# EAGLE design MotorDrive_REVB2 (EAGLE 6.2)

## Sheet 1 of 3
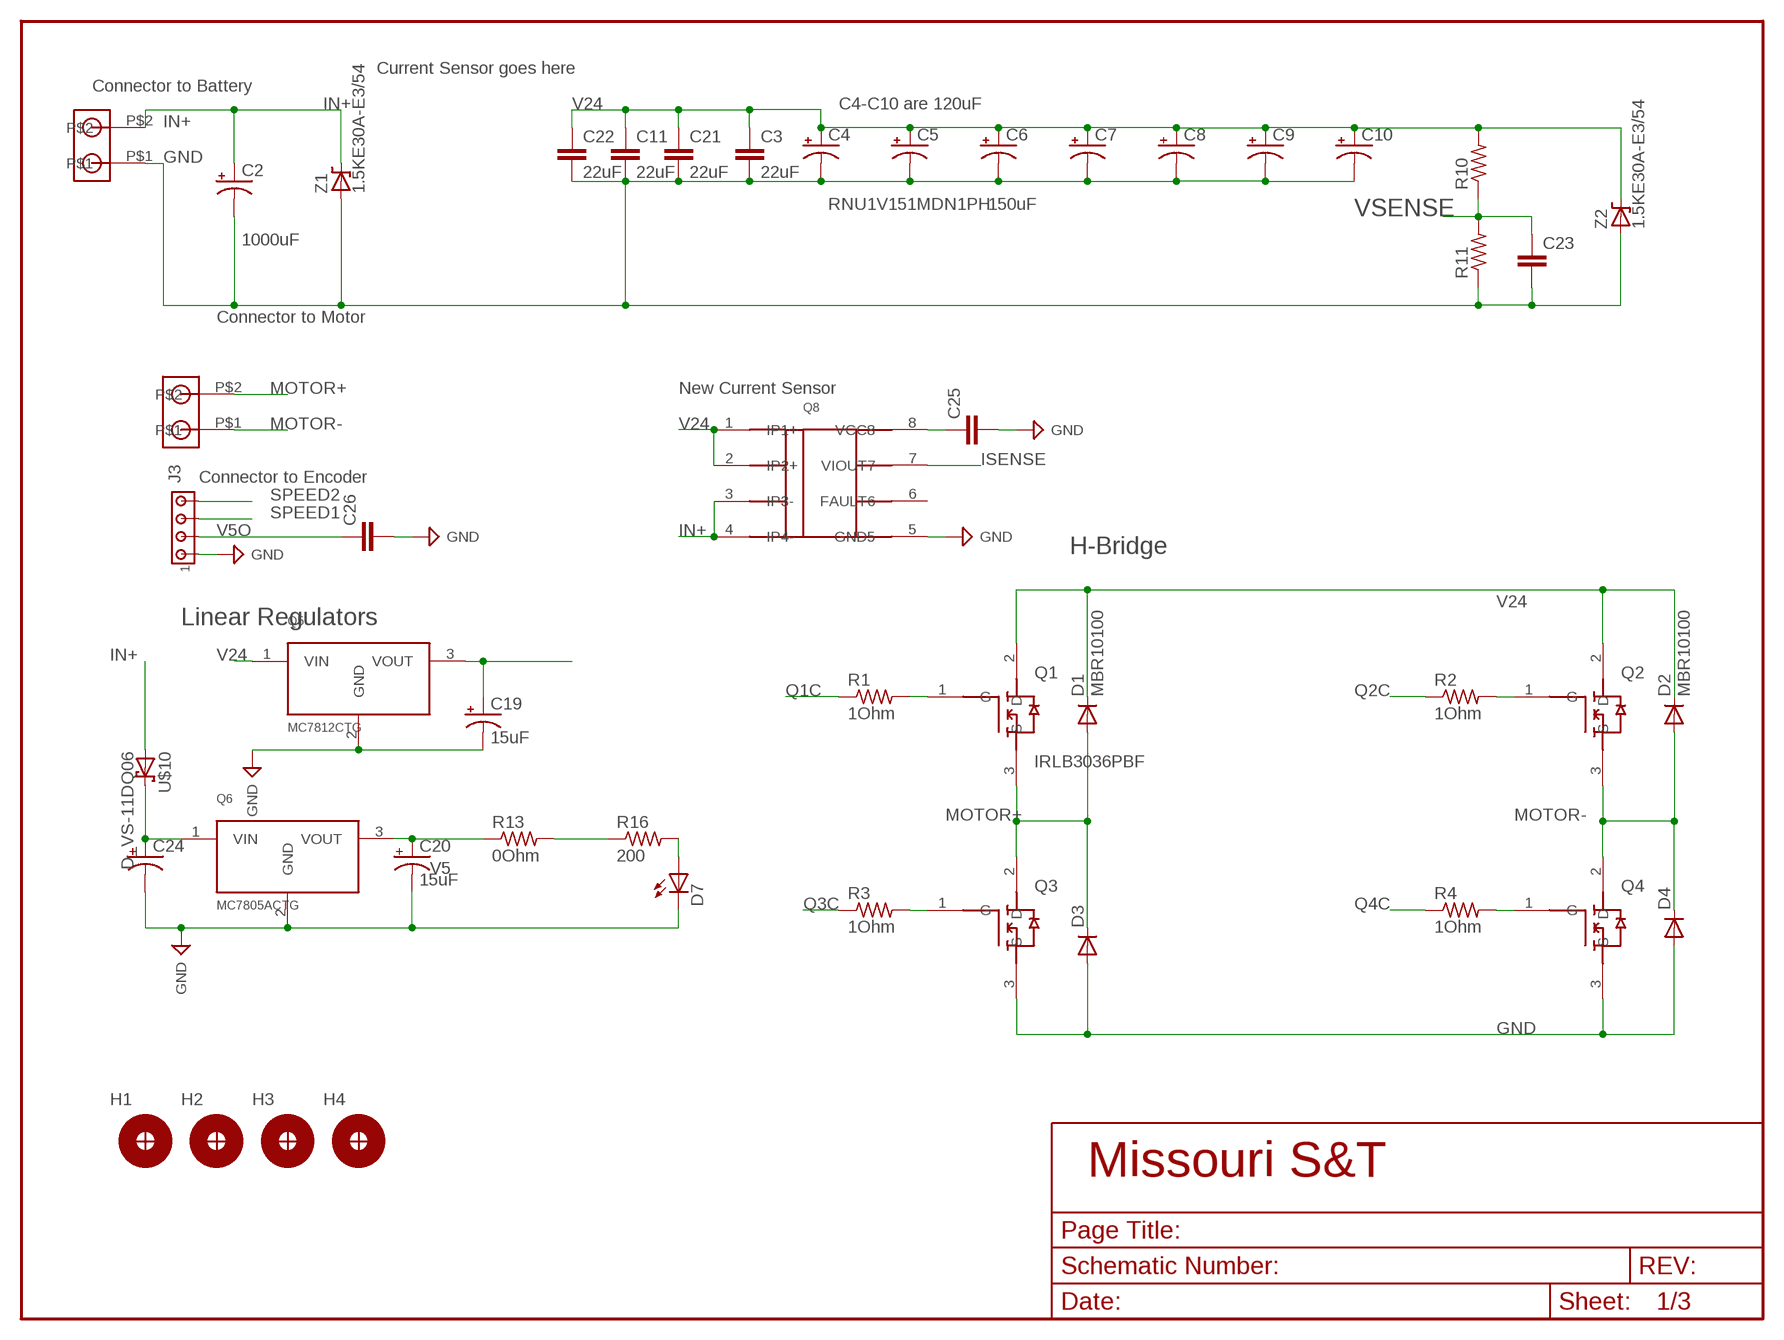
[diagram p0: schematic, sheet 1]

### Parts
C2  1000uF  C_10MM  [C_10MM]
C3  22uF  C_CAP_1206  [C_1206]
C4  RNU1V151MDN1PH  C_10MM  [C_10MM]
C5  C_10MM  [C_10MM]
C6  C_10MM  [C_10MM]
C7  C_10MM  [C_10MM]
C8  C_10MM  [C_10MM]
C9  C_10MM  [C_10MM]
C10  150uF  C_10MM  [C_10MM]
C11  22uF  C_CAP_1206  [C_1206]
C19  15uF  C_GA1E150  [C_2MM]
C20  15uF  C_POL8MM  [C_8MM]
C21  22uF  C_CAP_1206  [C_1206]
C22  22uF  C_CAP_1206  [C_1206]
C23  C_CAP_1206  [C_1206]
C24  C_POL_RAD_D8MM_LS200MIL_30MIL  [C_RAD_D8MM_LS200MIL_30MIL]
C25  C_CAP_1206  [C_1206]
C26  C_CAP_1206  [C_1206]
D1  MBR10100  D_FFPF10UA60ST  [TO220AC]
D2  MBR10100  D_FFPF10UA60ST  [TO220AC]
D3  D_FFPF10UA60ST  [TO220AC]
D4  D_FFPF10UA60ST  [TO220AC]
D7  D_LED_T1  [D_LED_T1]
H1  H_MNTHOLE_#4  [H_MNTHOLE_#4]
H2  H_MNTHOLE_#4  [H_MNTHOLE_#4]
H3  H_MNTHOLE_#4  [H_MNTHOLE_#4]
H4  H_MNTHOLE_#4  [H_MNTHOLE_#4]
J1  J_1546074-2  [THERM_BLOCK_2]
J2  J_1546074-2  [THERM_BLOCK_2]
J3  J_HDR1X4_MTA_100MIL  [J_MTA1X4_100MIL]
Q1  IRLB3036PBF  Q_IRLB3036PBF  [TO220_6025DG]
Q2  Q_IRLB3036PBF  [TO220_6025DG]
Q3  Q_IRLB3036PBF  [TO220_6025DG]
Q4  Q_IRLB3036PBF  [TO220_6025DG]
Q5  MC7812CTG  Q_LDO  [TO-220]
Q6  MC7805ACTG  Q_LDO  [TO-220]
Q8  Q_SO8ACS711  [Q_SO8]
R1  1Ohm  R_1/4W  [R_1/4W]
R2  1Ohm  R_1/4W  [R_1/4W]
R3  1Ohm  R_1/4W  [R_1/4W]
R4  1Ohm  R_1/4W  [R_1/4W]
R10  R_RES_1206  [R_1206]
R11  R_RES_1206  [R_1206]
R13  0Ohm  R_1/4W  [R_1/4W]
R16  200  R_RES_1206  [R_1206]
U$10  D_VS-11DQ06  [DO-204AL]
Z1  1.5KE30A-E3/54  D_1.5KE480A_D3.5MM_LS15.24MM  [DIODE_D3.5MM_LS15.24MM]
Z2  1.5KE30A-E3/54  D_1.5KE480A_D3.5MM_LS15.24MM  [DIODE_D3.5MM_LS15.24MM]

### Nets
B24V: C24.+ Q6.1(VIN) U$10.C
GND: C2.P$2(-) C3.2 C4.P$2(-) C5.P$2(-) C6.P$2(-) C7.P$2(-) C8.P$2(-) C9.P$2(-) C10.P$2(-) C11.2 C19.- C20.- C21.2 C22.2 C23.2 C24.- C25.2 C26.2 D3.3(A) D4.3(A) D7.K(C) J2.P$1 J3.1 Q3.3(S) Q4.3(S) Q5.2(GND) Q6.2(GND) Q8.5(GND5) R11.1 Z1.A Z2.A ; supply symbol labelled SUP_GND ; also sheet 2,3
IN+: C2.P$1(+) J2.P$2 Q8.3(IP3-) Q8.4(IP4-) U$10.A Z1.C(K)
ISENSE: Q8.7(VIOUT7) ; also sheet 3
MOTOR+: D1.3(A) D3.1(C) J1.P$2 Q1.3(S) Q3.2(D) ; also sheet 2
MOTOR-: D2.3(A) D4.1(C) J1.P$1 Q2.3(S) Q4.2(D) ; also sheet 2
N$2: Q1.1(G) R1.2
N$3: Q3.1(G) R3.2
N$4: Q2.1(G) R2.2
N$5: Q4.1(G) R4.2
N$23: D7.A R16.2
Q1C: R1.1 ; also sheet 2
Q2C: R2.1 ; also sheet 2
Q3C: R3.1 ; also sheet 2
Q4C: R4.1 ; also sheet 2
SPEED1: J3.3 ; also sheet 3
SPEED2: J3.4 ; also sheet 3
V5: C20.+ C25.1 Q6.3(VOUT) Q8.8(VCC8) R13.1 ; also sheet 2,3
V5O: C26.1 J3.2 R13.2 R16.1 ; also sheet 3
V12: C19.+ Q5.3(VOUT) ; also sheet 2
V24: C3.1 C4.P$1(+) C5.P$1(+) C6.P$1(+) C7.P$1(+) C8.P$1(+) C9.P$1(+) C10.P$1(+) C11.1 C21.1 C22.1 D1.1(C) D2.1(C) Q1.2(D) Q2.2(D) Q5.1(VIN) Q8.1(IP1+) Q8.2(IP2+) R10.2 Z2.C(K)
VSENSE: C23.1 R10.1 R11.2 ; also sheet 3
Unconnected: H1.1 H2.1 H3.1 H4.1 Q8.6(FAULT6)

### Notes on the sheet
- Current Sensor goes here
- Connector to Battery
- C4-C10 are 120uF
- Connector to Motor
- New Current Sensor
- Connector to Encoder
- H-Bridge
- Linear Regulators

## Sheet 2 of 3
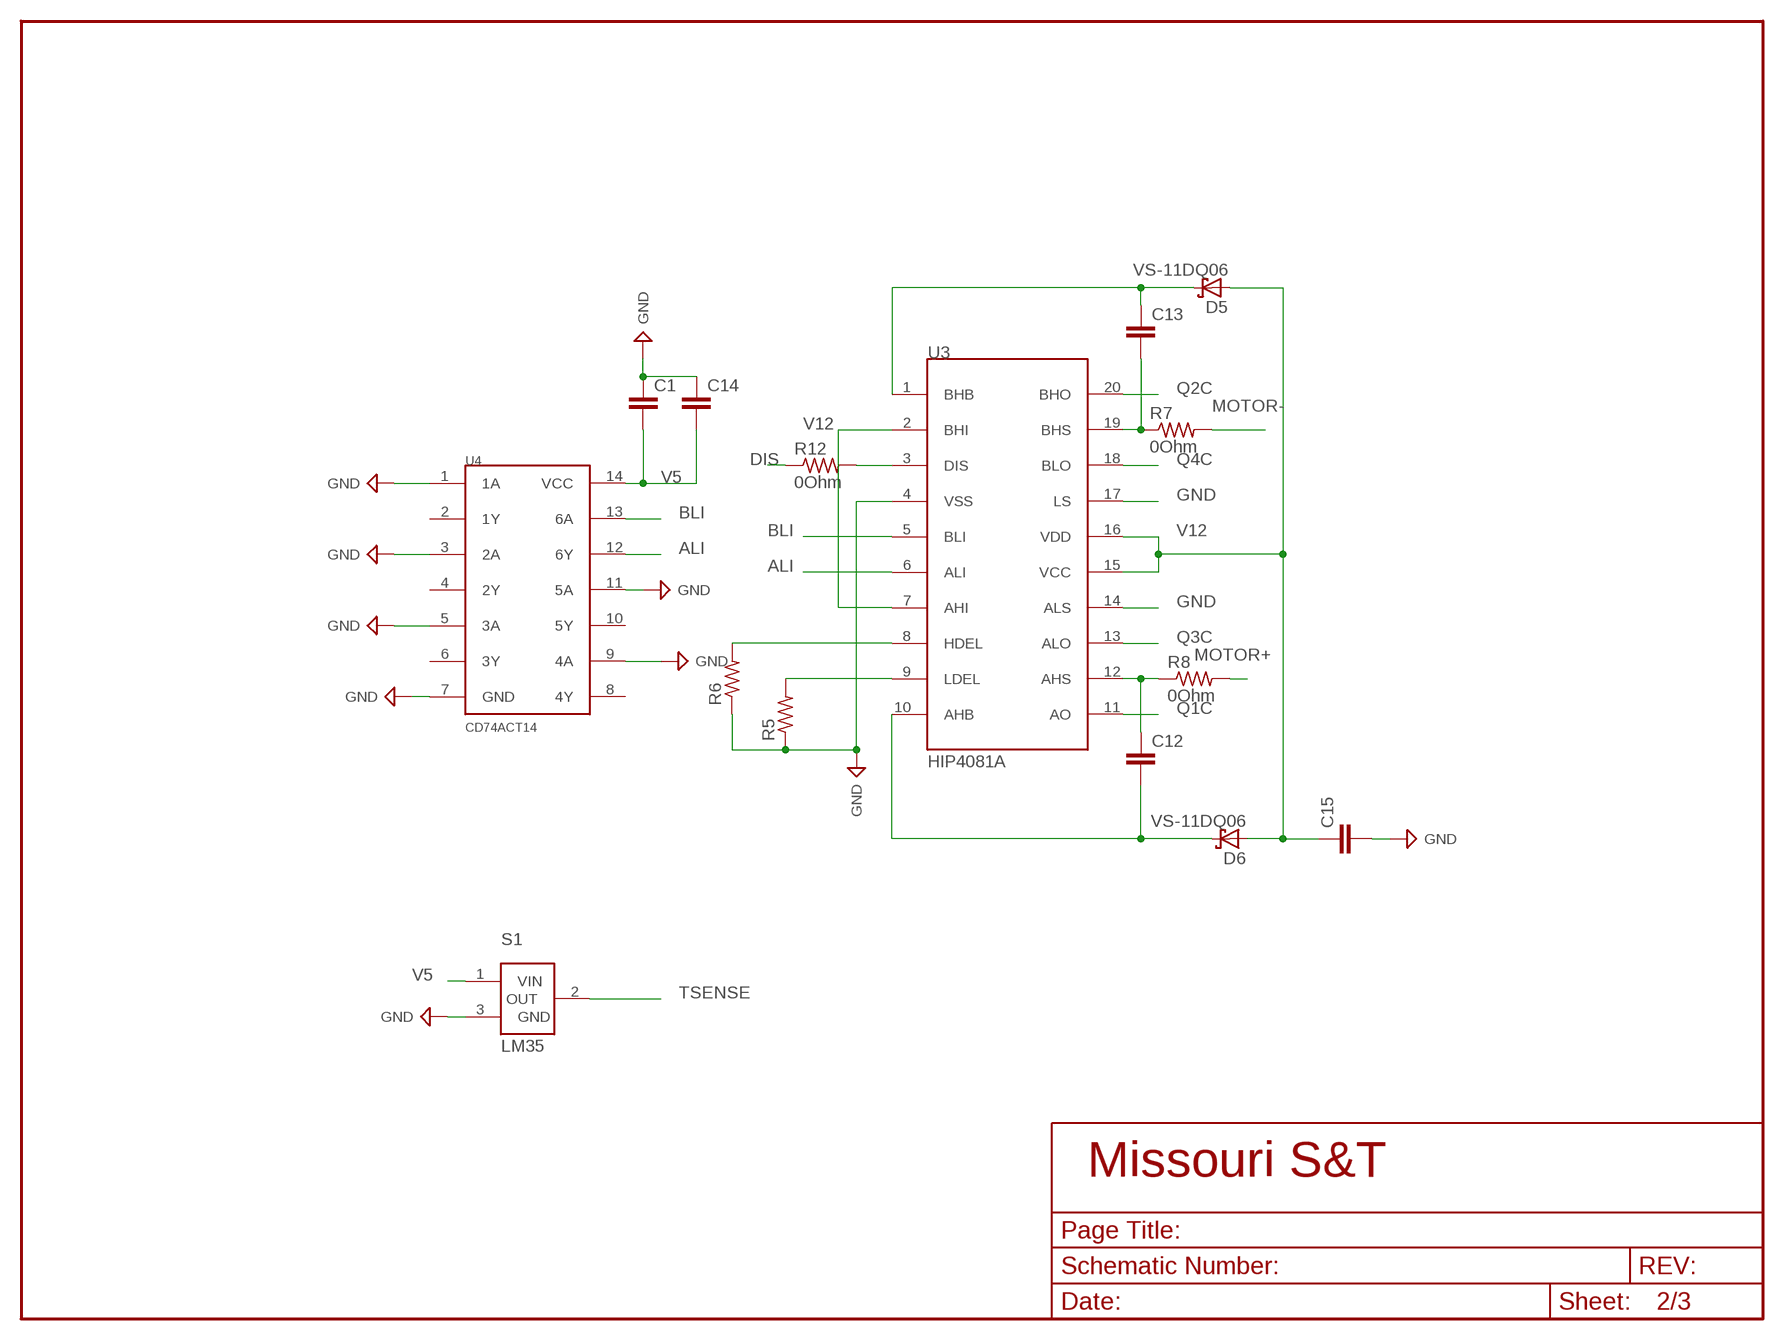
[diagram p1: schematic, sheet 2]

### Parts
C1  C_CAP_1206  [C_1206]
C12  C_CAP_1206  [C_1206]
C13  C_CAP_1206  [C_1206]
C14  C_CAP_1206  [C_1206]
C15  C_CAP_1206  [C_1206]
D5  VS-11DQ06  D_VS-11DQ06  [DO-204AL]
D6  VS-11DQ06  D_VS-11DQ06  [DO-204AL]
R5  R_RES_1206  [R_1206]
R6  R_RES_1206  [R_1206]
R7  0Ohm  R_1/4W  [R_1/4W]
R8  0Ohm  R_1/4W  [R_1/4W]
R12  0Ohm  R_1/4W  [R_1/4W]
S1  LM35  Q_LM35TO-92  [TO-92-3]
U3  HIP4081A  Q_HIP4081A  [DIP20]
U4  CD74ACT14  Q_CD74ACT14  [DIP14]

### Nets
ALI: U3.6(ALI) U4.12(6Y)
BLI: U3.5(BLI) U4.13(6A) ; also sheet 3
DIS: R12.1 ; also sheet 3
GND: C1.1 C14.1 C15.2 R5.1 R6.1 S1.3(GND) U3.4(VSS) U3.14(ALS) U3.17(LS) U4.1(1A) U4.3(2A) U4.5(3A) U4.7(GND) U4.9(4A) U4.11(5A) ; supply symbol labelled SUP_GND ; also sheet 1,3
MOTOR+: R8.2 ; also sheet 1
MOTOR-: R7.2 ; also sheet 1
N$1: C12.2 D6.C U3.10(AHB)
N$6: R6.2 U3.8(HDEL)
N$7: R5.2 U3.9(LDEL)
N$8: C13.1 D5.C U3.1(BHB)
N$11: C13.2 R7.1 U3.19(BHS)
N$13: C12.1 R8.1 U3.12(AHS)
N$14: R12.2 U3.3(DIS)
Q1C: U3.11(AO) ; also sheet 1
Q2C: U3.20(BHO) ; also sheet 1
Q3C: U3.13(ALO) ; also sheet 1
Q4C: U3.18(BLO) ; also sheet 1
TSENSE: S1.2(OUT) ; also sheet 3
V5: C1.2 C14.2 S1.1(VIN) U4.14(VCC) ; also sheet 1,3
V12: C15.1 D5.A D6.A U3.2(BHI) U3.7(AHI) U3.15(VCC) U3.16(VDD) ; also sheet 1
Unconnected: U4.2(1Y) U4.4(2Y) U4.6(3Y) U4.8(4Y) U4.10(5Y)

## Sheet 3 of 3
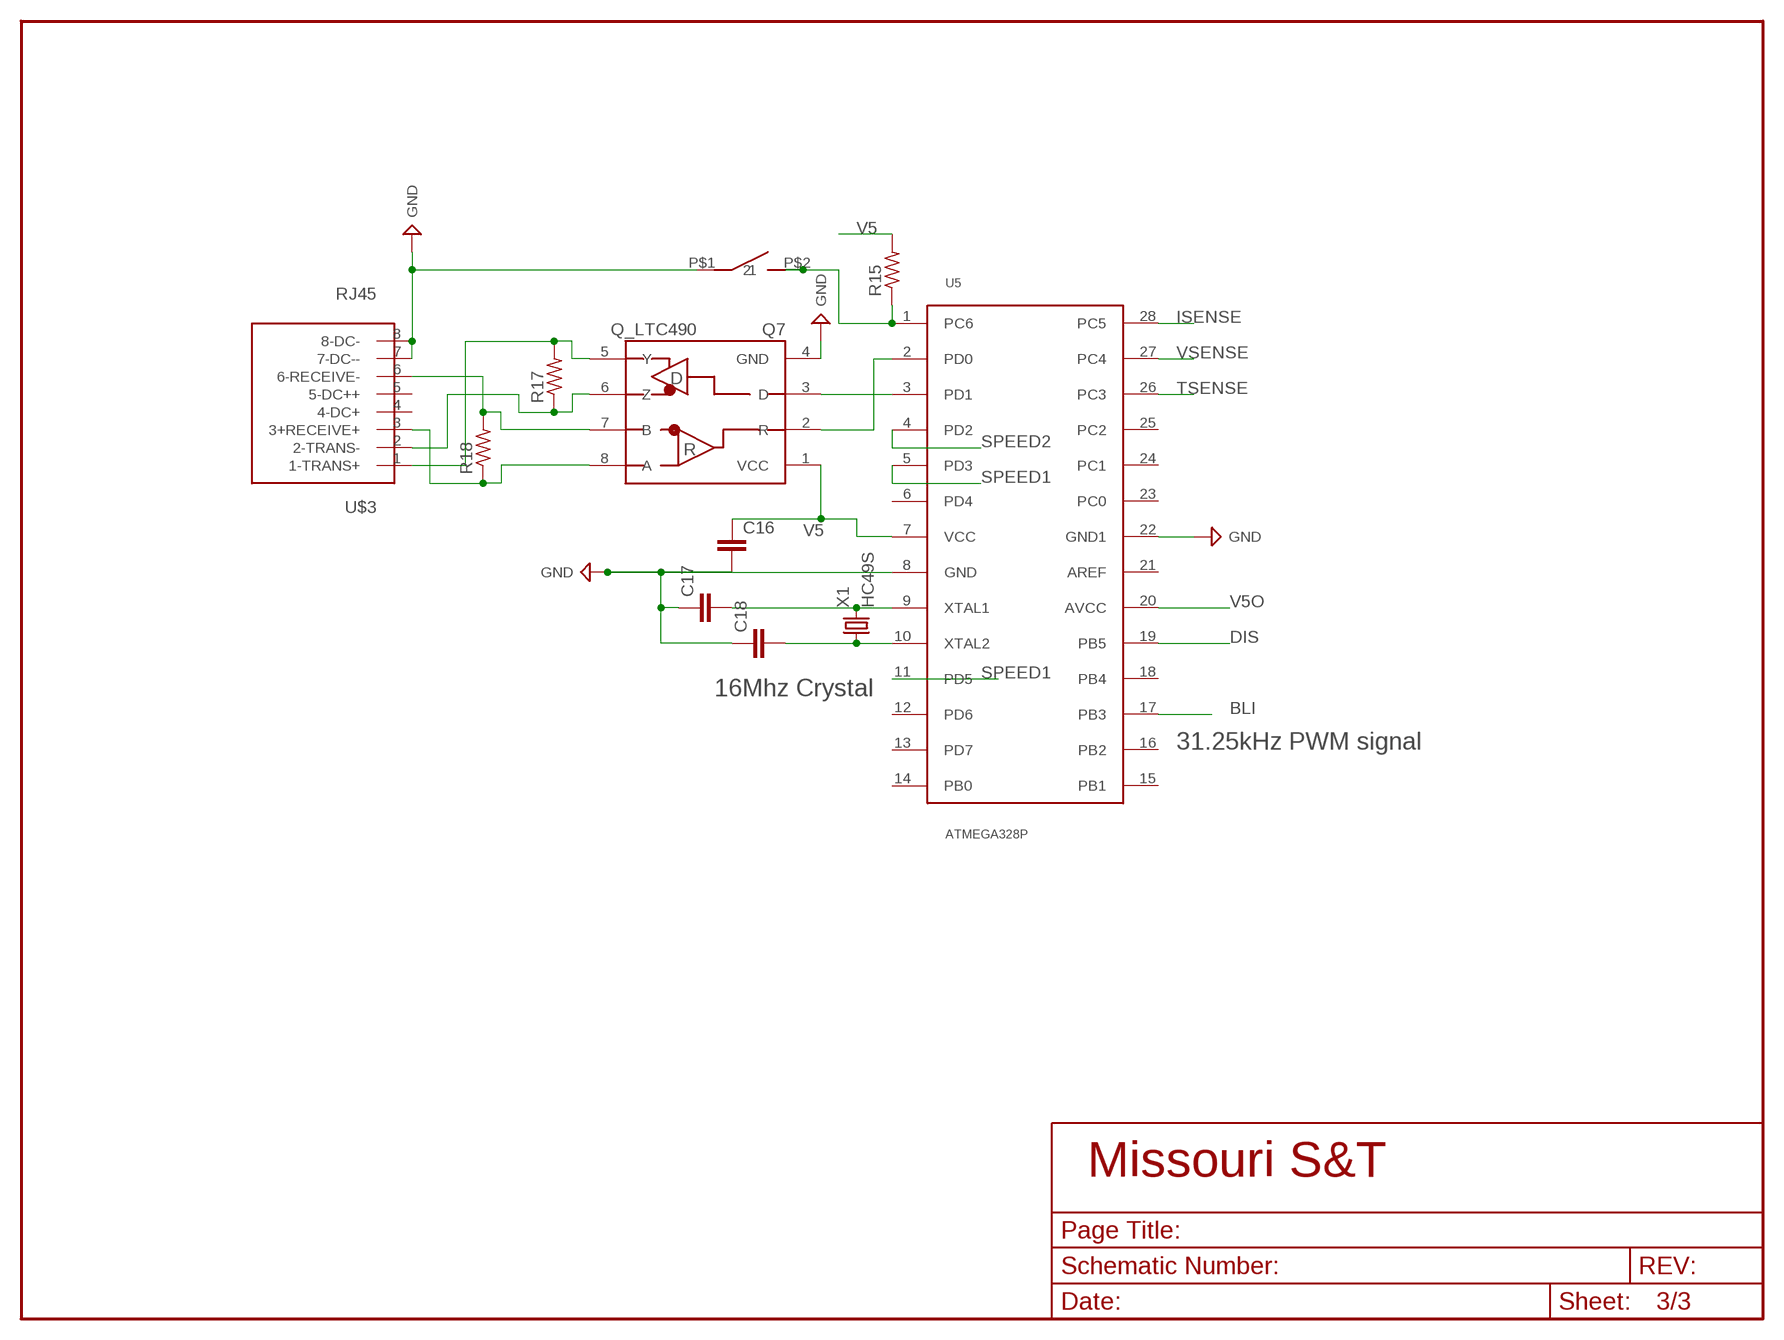
[diagram p2: schematic, sheet 3]

### Parts
C16  C_CAP_1206  [C_1206]
C17  C_CAP_1206  [C_1206]
C18  C_CAP_1206  [C_1206]
J8  J_MC32857  [J_TOGGLE]
Q7  Q_LTC490  [DIP8]
R15  R_RES_1206  [R_1206]
R17  R_RES_1206  [R_1206]
R18  R_RES_1206  [R_1206]
U5  ATMEGA328P  Q_ATMEGA328P  [DIP28]
U$3  RJ45  [RJ45-CAT5E]
X1  HC49S  X_HC49SCRYSTAL  [HC-49]

### Nets
BLI: U5.17(PB3) ; also sheet 2
DIS: U5.19(PB5) ; also sheet 2
GND: C16.2 C17.1 C18.1 J8.P$1 Q7.4(GND) U5.8(GND) U5.22(GND1) U$3.7(7-DC--) U$3.8(8-DC-) ; supply symbol labelled SUP_GND ; also sheet 1,2
ISENSE: U5.28(PC5) ; also sheet 1
N$9: C17.2 U5.9(XTAL1) X1.P$2
N$10: C18.2 U5.10(XTAL2) X1.P$1
N$12: Q7.2(R) U5.2(PD0)
N$15: Q7.3(D) U5.3(PD1)
N$16: Q7.6(Z) R17.1 U$3.2(2-TRANS-)
N$20: J8.P$2 R15.1 U5.1(PC6)
N$25: Q7.7(B) R18.2 U$3.6(6-RECEIVE-)
N$26: Q7.8(A) R18.1 U$3.3(3+RECEIVE+)
N$28: Q7.5(Y) R17.2 U$3.1(1-TRANS+)
SPEED1: U5.5(PD3) U5.11(PD5) ; also sheet 1
SPEED2: U5.4(PD2) ; also sheet 1
TSENSE: U5.26(PC3) ; also sheet 2
V5: C16.1 Q7.1(VCC) R15.2 U5.7(VCC) ; also sheet 1,2
V5O: U5.20(AVCC) ; also sheet 1
VSENSE: U5.27(PC4) ; also sheet 1
Unconnected: U5.6(PD4) U5.12(PD6) U5.13(PD7) U5.14(PB0) U5.15(PB1) U5.16(PB2) U5.18(PB4) U5.21(AREF) U5.23(PC0) U5.24(PC1) U5.25(PC2) U$3.4(4-DC+) U$3.5(5-DC++)

### Notes on the sheet
- 16Mhz Crystal
- 31.25kHz PWM signal

## Library data of the parts
C1 C3 C11-C18 C21-C23 C25 C26 = Lib_Passive:C_CAP
C2 C4-C10 = PCB0M1:C_10MM: Alum Elect. Cap with 10mm diameter, 5mm lead spacing and 0.7mm lead diameter
C19 = PCB0M1:C_GA1E150: EEA-GA1E150 CAPACITOR ALUM ELEC, 15UF, 20%, 25V, RADIAL 5mm diameter
C20 = PCB0M1:C_POL: Alum Elect. Cap with 10mm diameter, 5mm lead spacing and 0.7mm lead diameter
C24 = Lib_Passive:C_POL
D1-D4 = Lib_Katlyn:D_FFPF10UA60ST: Diode
D5 D6 U$10 = PCB0M1:D_VS-11DQ06: VS-11DQ06 SCHOTTKY RECTIFIER, 1.1A, 60V, DO-204AL
D7 = Lib_TH:D_LED
H1-H4 = Lib_TH:H_MNTHOLE
J1 J2 = PCB0M1:J_1546074-2
J3 = Lib_Electromechanical:J_HDR1X4: AMP connector
J8 = PCB0M1:J_MC32857: SWITCH, TACTILE, SPST-NO, 50mA, THD
Q1-Q4 = PCB0M1:Q_IRLB3036PBF: N CH MOSFET, 60V, 195A, TO-220AB with 6025DG 17.9C/W heatsink
Q5 Q6 = PCB0M1:Q_LDO: LDO with fixed ouput voltage
Q7 = PCB0M1:Q_LTC490: IC, RS422-RS485 DRVR
Q8 = Lib_MPPT:Q_SO8
R1-R4 R7 R8 R12 R13 = Lib_TH:R
R5 R6 R10 R11 R15-R18 = Lib_Passive:R_RES
S1 = PCB0M1:Q_LM35: IC, TEMPERATURE SENSOR, 0.4°C, TO-92-3
U3 = PCB0M1:Q_HIP4081A: 80V/2.5A Full Bridge FET Driver DIP20
U4 = PCB0M1:Q_CD74ACT14: HEX Schmitt-trigger Inverter
U5 = PCB0M1:Q_ATMEGA328P: ATMEGA 328P in 28PIN PDIP package
U$3 = PCB0M1:RJ45
X1 = PCB0M1:X_HC49SCRYSTAL: CRYSTAL METAL CAN, 16MHZ, 18PF, HC-49/US
Z1 Z2 = Lib_Katlyn:D_1.5KE480A: Zener Diode

## Board
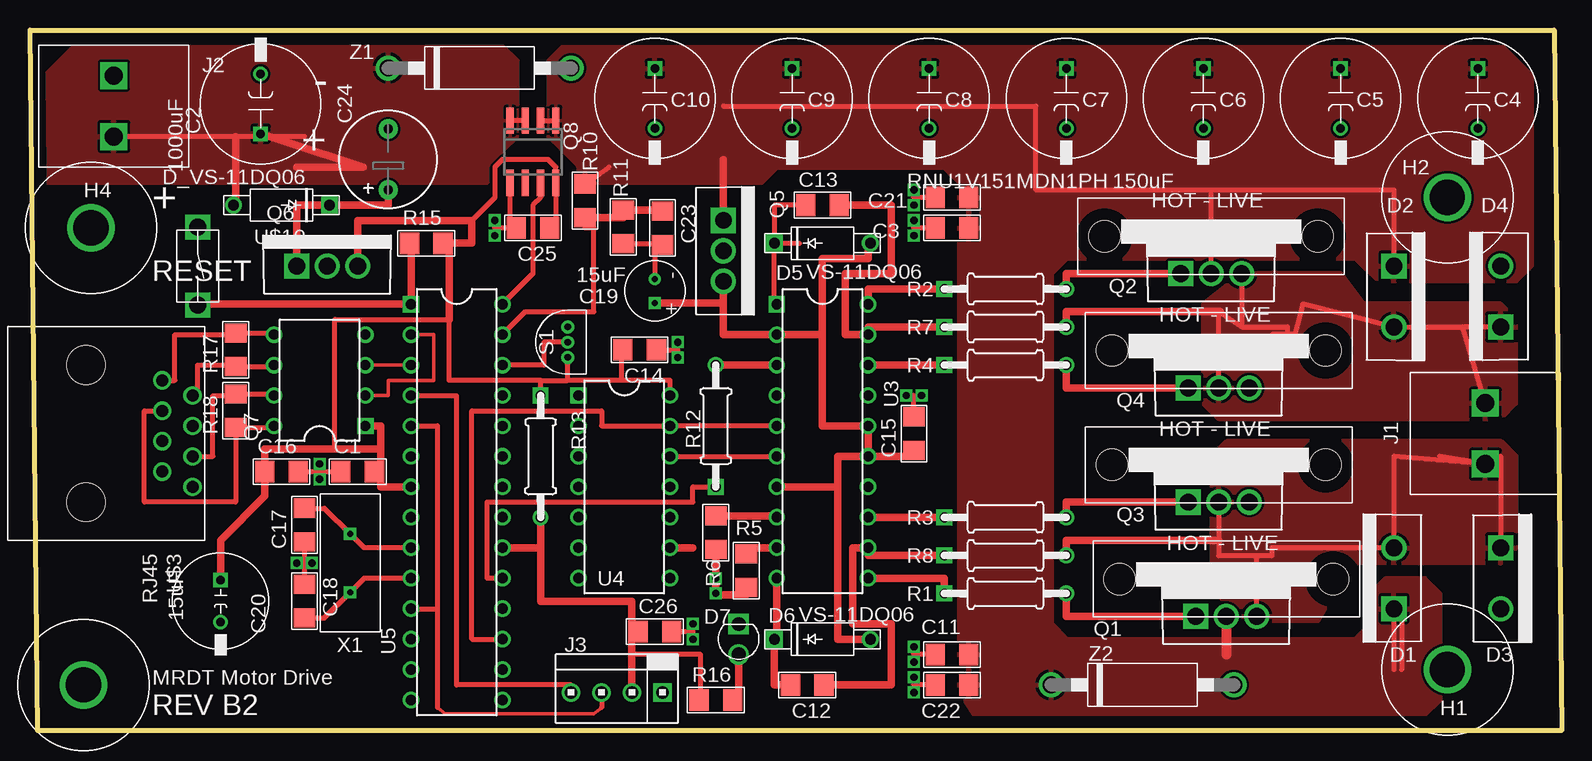
[diagram p3: board, top side]
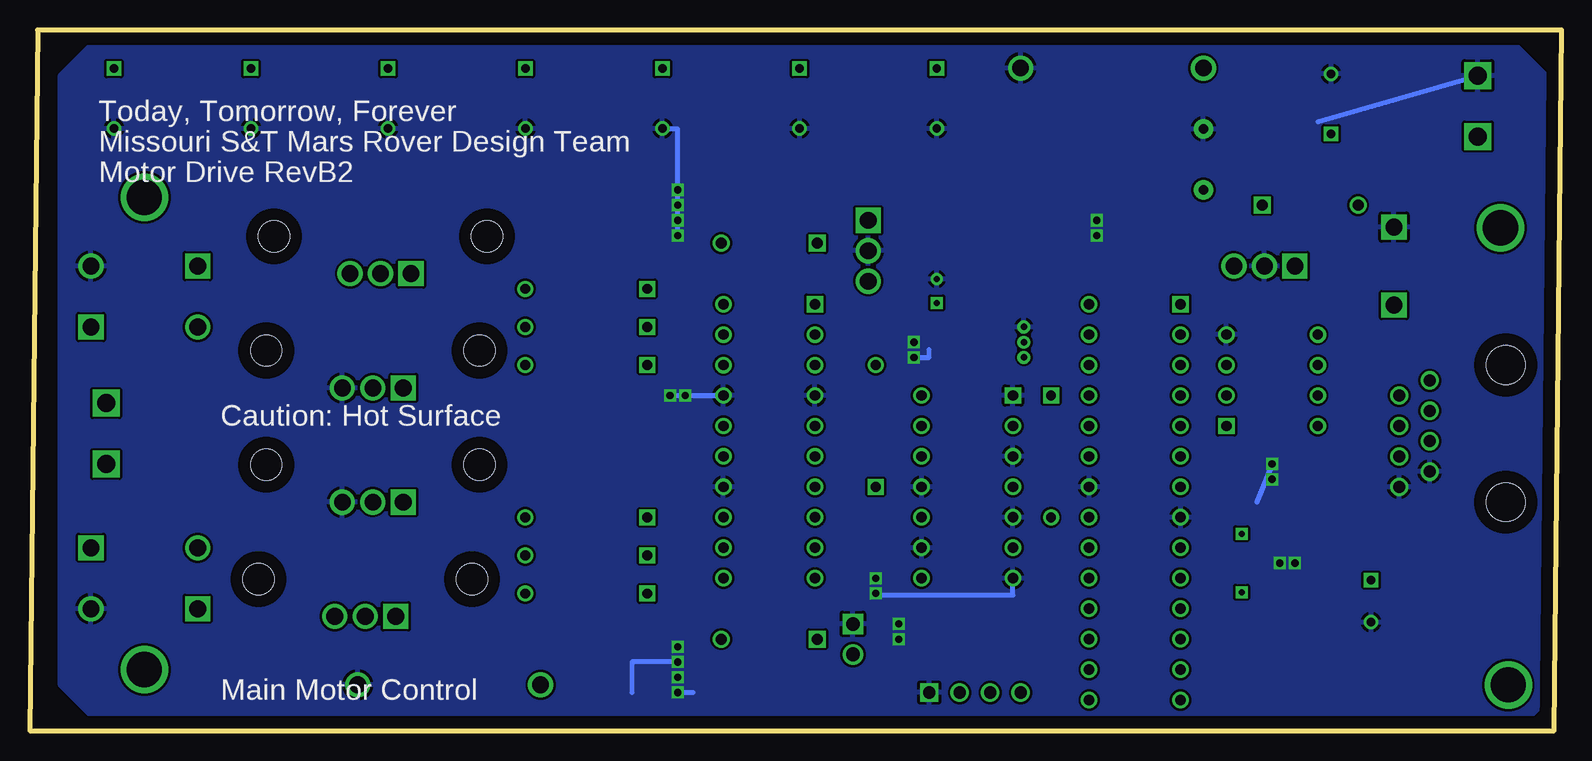
[diagram p4: board, bottom side, seen from below]

Size 127.64 x 58.42 mm. Coordinates in mm from the lower left corner, seen from the top.
Outline: 0.64,0 0,58.42 127,58.42 127.64,0 0.64,0
Copper layers (1*16): Top 0.035mm / dielectric 1.5mm / Bottom 0.035mm
Design rules "default": minimum track width 10mil, minimum drill 19mil, track to track 8mil, track to pad 8mil, pad to pad 8mil, via to via 8mil, smd to smd 8mil, copper to edge 40mil, drill to drill 8mil, minimum pad ring 10mil, minimum via ring 8mil, stop-mask expansion 4mil, vias tented up to drill 0mil, thermal gap 10mil

### Footprints (pad centres in the part's own frame; a part is rotated, then mirrored left to right if it is on the bottom)
C_1206 = smd 1.6 x 1.8: 1 -1.4,0; 2 1.4,0
C_10MM = drill 0.7 square: P$1 -2.5,0 | drill 0.7: P$2 2.5,0
C_2MM = drill 0.5 square: + -1,0 | drill 0.5: - 1,0
C_8MM = drill 0.7 square: + -1.75,0 | drill 0.7: - 1.75,0
C_RAD_D8MM_LS200MIL_30MIL = drill 0.762 pad 1.6: + -2.54,0; - 2.54,0
TO220AC = drill 1.397 square: 1 -2.54,0 | drill 1.397: 3 2.54,0
DO-204AL = drill 0.9: A 3.995,0 | drill 0.9 square: C -4.005,0
D_LED_T1 = drill 1.143: A -1.27,0 | drill 1.143 square: K 1.27,0
H_MNTHOLE_#4 = drill 2.946: 1 0,0
THERM_BLOCK_2 = drill 1.5 square: P$1 2.54,0; P$2 -2.54,0
J_MTA1X4_100MIL = drill 1.016 square: 1 3.81,0 | drill 1.016: 2 1.27,0; 3 -1.27,0; 4 -3.81,0
J_TOGGLE = drill 1.4 square: P$1 -3.25,0; P$2 3.25,0
TO220_6025DG = drill 1.397 square: 1 -2.54,0 | drill 1.397: 2 0,0; 3 2.54,0 | hole 2.6: -8.89,3.115; 8.89,3.115
TO-220 = drill 1.397 square: 1 -2.54,0 | drill 1.397: 2 0,0; 3 2.54,0
DIP8 = drill 0.864 square: 1 -3.81,-3.81 | drill 0.864: 2 -1.27,-3.81; 3 1.27,-3.81; 4 3.81,-3.81; 5 3.81,3.81; 6 1.27,3.81; 7 -1.27,3.81; 8 -3.81,3.81
Q_SO8 = smd 2.2 x 0.6: 1 -2.6,1.905; 2 -2.6,0.635; 3 -2.6,-0.635; 4 -2.6,-1.905; 5 2.6,-1.905; 6 2.6,-0.635; 7 2.6,0.635; 8 2.6,1.905
R_1/4W = drill 0.813 square: 1 -5.08,0 | drill 0.813: 2 5.08,0
R_1206 = smd 1.6 x 1.8: 1 -1.4,0; 2 1.4,0
TO-92-3 = drill 0.55: 1 1.27,0; 2 0,0; 3 -1.27,0
DIP20 = drill 0.864 square: 1 -11.43,-3.81 | drill 0.864: 2 -8.89,-3.81; 3 -6.35,-3.81; 4 -3.81,-3.81; 5 -1.27,-3.81; 6 1.27,-3.81; 7 3.81,-3.81; 8 6.35,-3.81; 9 8.89,-3.81; 10 11.43,-3.81; 11 11.43,3.81; 12 8.89,3.81; 13 6.35,3.81; 14 3.81,3.81; 15 1.27,3.81; 16 -1.27,3.81; 17 -3.81,3.81; 18 -6.35,3.81; 19 -8.89,3.81; 20 -11.43,3.81
DIP14 = drill 0.864 square: 1 -7.62,-3.81 | drill 0.864: 2 -5.08,-3.81; 3 -2.54,-3.81; 4 0,-3.81; 5 2.54,-3.81; 6 5.08,-3.81; 7 7.62,-3.81; 8 7.62,3.81; 9 5.08,3.81; 10 2.54,3.81; 11 0,3.81; 12 -2.54,3.81; 13 -5.08,3.81; 14 -7.62,3.81
DIP28 = drill 0.864 square: 1 -16.51,-3.81 | drill 0.864: 2 -13.97,-3.81; 3 -11.43,-3.81; 4 -8.89,-3.81; 5 -6.35,-3.81; 6 -3.81,-3.81; 7 -1.27,-3.81; 8 1.27,-3.81; 9 3.81,-3.81; 10 6.35,-3.81; 11 8.89,-3.81; 12 11.43,-3.81; 13 13.97,-3.81; 14 16.51,-3.81; 15 16.51,3.81; 16 13.97,3.81; 17 11.43,3.81; 18 8.89,3.81; 19 6.35,3.81; 20 3.81,3.81; 21 1.27,3.81; 22 -1.27,3.81; 23 -3.81,3.81; 24 -6.35,3.81; 25 -8.89,3.81; 26 -11.43,3.81; 27 -13.97,3.81; 28 -16.51,3.81
RJ45-CAT5E = drill 1: 1 -4.445,4.655; 2 -3.175,7.195; 3 -1.905,4.655; 4 -0.635,7.195; 5 0.635,4.655; 6 1.905,7.195; 7 3.175,4.655; 8 4.445,7.195 | hole 3.2: 5.715,-1.695; -5.715,-1.695
HC-49 = drill 0.5 square: P$1 -2.44,0; P$2 2.44,0
DIODE_D3.5MM_LS15.24MM = drill 1.397: A 7.62,0; C -7.62,0

### Placement (x,y rotation side)
C1  27.3,21.59 0 top
C2  19.21,52.26 90 top
C3  76.83,41.91 180 top
C4  120.65,52.7 270 top
C5  109.22,52.7 270 top
C6  97.79,52.7 270 top
C7  86.36,52.7 270 top
C8  74.93,52.7 270 top
C9  63.5,52.7 270 top
C10  52.07,52.7 270 top
C11  76.83,6.35 180 top
C12  64.77,3.81 180 top
C13  66.04,43.81 0 top
C14  50.8,31.75 180 top
C15  73.66,24.77 90 top
C16  20.95,21.59 0 top
C17  22.86,17.14 90 top
C18  22.86,10.79 270 top
C19  52.07,36.66 90 top
C20  15.88,10.79 270 top
C21  76.83,44.45 180 top
C22  76.83,3.81 180 top
C23  52.7,41.91 270 top
C24  29.84,47.62 90 top
C25  41.91,41.91 180 top
C26  52.07,8.26 0 top
D1  113.67,12.7 90 top
D2  113.67,36.2 270 top
D3  122.56,12.7 270 top
D4  122.56,36.2 90 top
D5  66.04,40.64 0 top
D6  66.04,7.62 0 top
D7  59.05,7.62 90 top
H1  118.11,5.08 0 top
H2  118.11,44.45 0 top
H3  4.45,3.81 0 top
H4  5.08,41.91 0 top
J1  121.28,24.77 90 top
J2  6.99,52.07 90 top
J3  48.9,3.17 0 top
J8  13.97,38.73 270 top
Q1  99.69,9.53 0 top
Q2  98.42,38.1 0 top
Q3  99.06,19.05 0 top
Q4  99.06,28.57 0 top
Q5  57.78,40.01 270 top
Q6  24.77,38.73 0 top
Q7  24.13,29.21 90 top
Q8  41.91,48.26 270 top
R1  81.28,11.43 0 top
R2  81.28,36.83 0 top
R3  81.28,17.78 0 top
R4  81.28,30.48 0 top
R5  59.69,13.34 90 top
R6  57.15,16.51 90 top
R7  81.28,33.66 0 top
R8  81.28,14.61 0 top
R10  46.26,44.18 90 top
R11  49.44,42.01 90 top
R12  57.15,25.4 90 top
R13  42.55,22.86 270 top
R15  33.02,40.64 0 top
R16  57.15,2.54 0 top
R17  17.14,31.75 90 top
R18  17.14,26.67 90 top
S1  44.81,32.38 270 top
U3  66.04,24.13 270 top
U4  49.53,20.32 270 top
U5  35.56,19.05 270 top
U$3  6.35,24.77 270 top
U$10  20.95,43.81 180 top
X1  26.67,13.97 90 top
Z1  37.47,55.24 0 top
Z2  92.71,3.81 0 top

### Tracks (layer width: path | path; a pad name or v marks a point on that pad's centre or on a via)
ALI
  Top 0.406: U4.12 U3.6
B24V
  Top 0.61: Q6.1 22.23,43.81 U$10.C 29.84,43.81 C24.+
BLI
  Top 0.406: U3.5 U4.13 47.62,25.4 47.62,26.67 36.83,26.67 36.83,7.62 U5.17
DIS
  Top 0.406: U5.19 38.1,12.7 38.1,19.05 55.24,19.05 55.24,20.32 R12.1
GND  (via drill 0.6)
  Top 0.406: R11.1 52.07,40.6 C19.- | C3.2 73.66,41.91 | 73.66,41.91 v73.66,42.55 | 73.66,41.91 v73.66,41.27 | C11.2 73.66,6.35 | 73.66,6.35 v73.66,6.99 | 73.66,6.35 v73.66,5.71 | C15.2 73.66,27.94 | 73.66,27.94 v73.03,27.94 | 73.66,27.94 v74.3,27.94 | v24.13,20.95 24.13,21.59 | C14.1 53.98,31.75 | 53.98,31.75 v53.98,32.38 | 53.98,31.75 v53.98,31.11 | C22.2 73.66,3.81 | 73.66,3.81 v73.66,4.45 | 73.66,3.81 v73.66,3.17 | C21.2 73.66,44.45 | 73.66,44.45 v73.66,43.81 | 73.66,44.45 v73.66,45.09 | Q8.5 40.01,41.91 C25.2 38.73,41.91 | 38.73,41.91 v38.73,42.55 | 38.73,41.91 v38.73,41.27 | C16.2 24.13,21.59 | 24.13,21.59 C1.1 | v24.13,22.23 24.13,21.59 | C17.1 22.86,13.97 | 22.86,13.97 v23.5,13.97 | v22.23,13.97 22.86,13.97 | 22.86,13.97 C18.1 | C26.2 55.24,8.26 v55.24,7.62 v55.24,8.89
  Top 0.61: R6.1 v57.15,12.7 v57.15,11.43 57.15,11.3 59.69,11.3 R5.1 | 52.7,40.01 C23.2 52.07,40.51 52.07,40.6 | U4.9 55.24,15.24
  Bottom 0.406: 20.32,50.76 J2.P$1 | 57.15,11.3 45.72,11.3 U4.7 | v73.66,41.27 v73.66,42.55 v73.66,43.81 v73.66,45.09 73.66,50.16 74.93,50.16 C8.P$2 | v73.66,5.71 77.47,5.71 77.47,3.17 | v74.3,27.94 v73.03,27.94 U3.17 | v24.13,22.23 25.4,19.05 | v53.98,31.11 52.7,31.11 52.7,31.75 | v73.66,3.17 72.39,3.17
  pour Bottom: 1.27,54.61 1.27,2.54 3.81,0 122.56,1.27 125.09,3.81 125.09,54.61 122.56,57.15 3.81,57.15
IN+
  Top 0.406: 22.86,49.53 17.14,49.53 J2.P$2 | Q8.3 Q8.4
  Top 0.61: 22.23,46.99 27.78,46.99 C2.P$1 | U$10.A 17.14,43.81 17.14,49.53
  pour Top: 38.1,45.72 38.1,57.15 3.81,57.15 1.27,54.61 1.27,45.72
  pour Top: 38.1,45.72 38.1,46.99 39.37,48.26 40.64,49.53 40.64,55.88 39.37,57.15 36.83,57.15 36.83,45.72
ISENSE
  Top 0.406: Q8.7 42.55,44.45 41.91,43.81 41.91,38.1 U5.28
MOTOR+
  Top 0.406: J1.P$2 117.47,22.86 | 102.23,14.61 99.06,14.61 99.06,15.88 Q3.2 | 102.23,14.61 103.5,14.61 103.5,15.24 D1.3 113.67,22.86 J1.P$2 | J1.P$2 122.56,22.86 D3.1 | Q1.3 102.23,14.61
  Top 0.61: R8.2 86.36,15.88 99.06,15.88
  pour Top: 99.78,24.13 122.56,24.13 123.83,22.86 123.83,15.24 122.56,13.97 109.86,13.97 108.58,12.7 108.58,11.43 107.31,9.16 100.78,9.16 98.78,11.7 98.5,12.97 98.5,22.86
MOTOR-
  Top 0.406: 100.97,33.66 99.06,34.92 Q4.2 | 100.97,33.66 104.78,33.66 104.78,33.02 | 119.38,33.66 D2.3 106.05,35.56 105.41,33.02 104.78,33.02 | J1.P$1 119.38,33.66 | D4.1 119.38,33.66 | 104.78,33.02 103.5,33.02 | Q2.3 100.97,33.66
  Top 0.61: R7.2 86.36,34.92 99.21,34.92 99.21,34.83
  pour Top: 99.06,26.04 122.56,26.04 123.83,27.3 123.83,34.29 122.56,35.56 111.12,35.56 109.22,38.1 100.97,38.1 97.79,35.56 97.79,27.3
N$1
  Top 0.61: C12.2 62.03,3.81 D6.C 62.23,7.62 U3.10
N$2
  Top 0.61: R1.2 86.36,9.53 Q1.1
N$3
  Top 0.61: R3.2 86.36,19.05 Q3.1
N$4
  Top 0.61: R2.2 86.36,38.1 Q2.1
N$5
  Top 0.61: R4.2 86.36,28.57 Q4.1
N$6
  Top 0.61: R6.2 62.23,17.91 U3.8
N$7
  Top 0.61: R5.2 59.69,15.24 U3.9
N$8
  Top 0.406: D5.C 64.14,40.64 | U3.1 62.03,35.56 D5.C | C13.1 62.03,43.81 D5.C
N$9
  Top 0.406: U5.9 27.84,15.24 X1.P$2 24.54,18.55 C17.2
N$10
  Top 0.406: U5.10 27.84,12.7 X1.P$1 24.54,9.39 C18.2
N$11
  Top 0.61: R7.1 69.85,33.66 U3.19 67.94,33.02 67.94,38.1 71.75,38.1 71.75,43.81 C13.2
N$12
  Top 0.305: U5.2 33.66,33.02 33.66,29.21 29.84,29.21 29.84,27.94 Q7.2
N$13
  Top 0.61: R8.1 69.85,14.61 U3.12 68.58,15.24 68.58,8.89 71.75,8.89 71.75,3.81 C12.1
N$14
  Top 0.61: R12.2 U3.3
N$15
  Top 0.305: Q7.3 U5.3
N$16
  Top 0.406: Q7.6 20.32,30.35 R17.1 17.78,30.48 13.97,30.48 13.97,27.94 U$3.2
N$20
  Top 0.61: J8.P$2 13.97,35.56 U5.1 31.75,40.64 R15.1
N$23
  Top 0.61: R16.2 59.05,2.54 D7.A
N$25
  Top 0.406: Q7.7 20.32,28.07 R18.2 17.78,27.94 15.24,27.94 15.24,22.86 U$3.6
N$26
  Top 0.406: Q7.8 20.32,25.27 R18.1 17.14,19.05 9.53,19.05 9.53,26.67 U$3.3
N$28
  Top 0.406: Q7.5 20.32,33.15 R17.2 17.78,33.02 12.06,33.02 12.06,29.21 U$3.1
Q1C
  Top 0.61: U3.11 76.2,12.7 R1.1
Q2C
  Top 0.61: R2.1 69.85,36.83 U3.20
Q3C
  Top 0.61: U3.13 R3.1
Q4C
  Top 0.61: R4.1 U3.18
SPEED1
  Top 0.305: 47.62,1.91 46.99,1.4 34.61,1.4 33.97,1.91
  Top 0.406: J3.3 47.62,1.91 | 33.97,1.91 33.97,10.16 | 33.97,10.16 33.97,25.4 U5.5 | U5.11 33.97,10.16
SPEED2
  Top 0.406: U5.4 35.56,27.94 35.56,3.81 45.09,3.81 J3.4
TSENSE
  Top 0.406: S1.2 42.81,32.38 42.81,30.48 U5.26
V5
  Top 0.406: U4.14 53.34,29.21 49.26,29.21 | 49.26,29.21 44.81,29.21 | 49.26,29.21 49.26,32 49.4,32 C14.2 | 29.34,20.32 C1.2 | R13.1 42.55,29.21 | 42.55,29.21 34.92,29.21 34.92,34.29 25.4,34.29 25.4,23.5 29.21,23.5 | C25.1 43.81,41.91 Q8.8 43.81,46.99 43.18,47.62 39.37,47.62 38.73,46.99 38.73,44.45 36.83,42.55 | 42.55,29.21 44.81,29.21 | 44.81,29.21 S1.1
  Top 0.61: 34.92,34.29 34.92,40.64 R15.2 36.83,40.64 36.83,42.55 27.3,42.55 Q6.3 | 29.21,23.5 29.21,20.32 29.34,20.32 U5.7 | 29.21,23.5 19.55,23.5 C16.1 19.55,19.55 15.88,15.88 C20.+ | Q7.1 29.21,25.4 29.21,23.5
V5O
  Top 0.406: C26.1 50.16,9.53 | R16.1 55.88,2.54 55.88,6.35 50.16,6.35
  Top 0.61: J3.2 50.16,6.35 50.16,9.53 50.16,10.79 42.55,10.79 R13.2 42.55,15.24 U5.20
V12
  Top 0.406: 73.66,22.86 C15.1
  Top 0.61: D5.A 69.85,40.64 69.85,39.37 66.04,39.37 66.04,33.02 | 66.04,33.02 66.04,25.4 U3.16 U3.15 | 66.04,33.02 U3.2 57.78,33.02 57.78,35.66 | 57.78,35.66 Q5.3 | C19.+ 57.78,35.66 | U3.15 73.66,22.86 | U3.15 67.31,22.86 67.31,20.32 | 67.31,20.32 U3.7 | 67.31,20.32 67.31,7.62 D6.A
V24
  Top 0.406: 98.42,45.09 113.67,45.09 D2.1 | 98.42,45.09 83.82,45.09 83.82,52.07 57.78,52.07 | 113.67,5.08 D1.1 114.3,10.16 114.3,5.08 | Q2.2 98.42,45.09 | R10.2 48.26,46.99 | Q8.2 Q8.1
  Top 0.61: Q5.1 57.78,47.62
  Top 0.813: Q1.2 99.69,6.35
  pour Top: 113.03,12.7 116.2,12.7 117.47,11.43 117.47,2.54 116.2,1.27 78.74,1.27 77.47,3.17 77.47,55.88 78.74,57.15 122.56,57.15 125.09,54.61 125.09,38.73 123.83,37.47 112.39,37.47 110.49,39.37 86.36,39.37 85.09,38.1 85.09,8.89 86.36,7.62 110.49,7.62 111.76,8.89 111.76,11.43
  pour Top: 78.74,57.15 45.72,57.15 44.45,55.88 45.72,46.99 45.72,45.72 60.96,45.72 62.23,46.99 76.2,46.99 77.47,45.72 78.74,45.72
  pour Top: 49.53,57.15 44.45,57.15 43.18,55.88 43.18,49.53 45.72,46.99 45.72,45.72 49.53,45.72
VSENSE
  Top 0.406: R10.1 46.26,41.91 46.99,41.91 46.99,34.92 41.27,34.92 U5.27 | 49.44,42.78 R11.2
  Top 0.61: 49.44,42.78 R10.1 | R11.2 52.7,43.41 C23.1

### Text on the board
tPlace: - | + | + | RESET | MRDT Motor Drive | REV B2
bPlace: Today, Tomorrow, Forever | Missouri S&T Mars Rover Design Team | Motor Drive RevB2 | Caution: Hot Surface | Main Motor Control
Drill_legend: Drill legend | Date: 1/30/2014 1:14:33 PM | 3.2000 mm / 125.984 mil count= 2 | 2.9464 mm / 116.000 mil count= 4 | 2.6000 mm / 102.362 mil count= 8 | 1.5000 mm / 59.055 mil count= 4 | 1.4000 mm / 55.118 mil count= 2 | 1.3970 mm / 55.000 mil count= 30 | 1.1430 mm / 45.000 mil count= 2 | 1.0160 mm / 40.000 mil count= 4 | 1.0000 mm / 39.370 mil count= 8 | 0.9000 mm / 35.433 mil count= 6 | 0.8636 mm / 34.000 mil count= 70 | 0.8128 mm / 32.000 mil count= 16 | 0.7620 mm / 30.000 mil count= 2 | 0.7000 mm / 27.559 mil count= 18 | 0.6000 mm / 23.622 mil count= 22 | 0.5500 mm / 21.654 mil count= 3 | 0.5000 mm / 19.685 mil count= 4